# Altium schematic sheet harness_subscheet.SchDoc
size A4; SheetNumber: 3; SheetTotal: 3
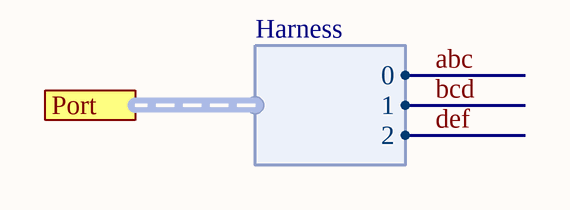
[diagram p0: harness_subscheet.SchDoc]

## Ports
Port (harness Harness)

## Harnesses
Harness: 0, 1, 2

## Nets
abc: port Port.0
bcd: port Port.1
def: port Port.2